# Altium schematic sheet STM32四轴.SchDoc
size A3
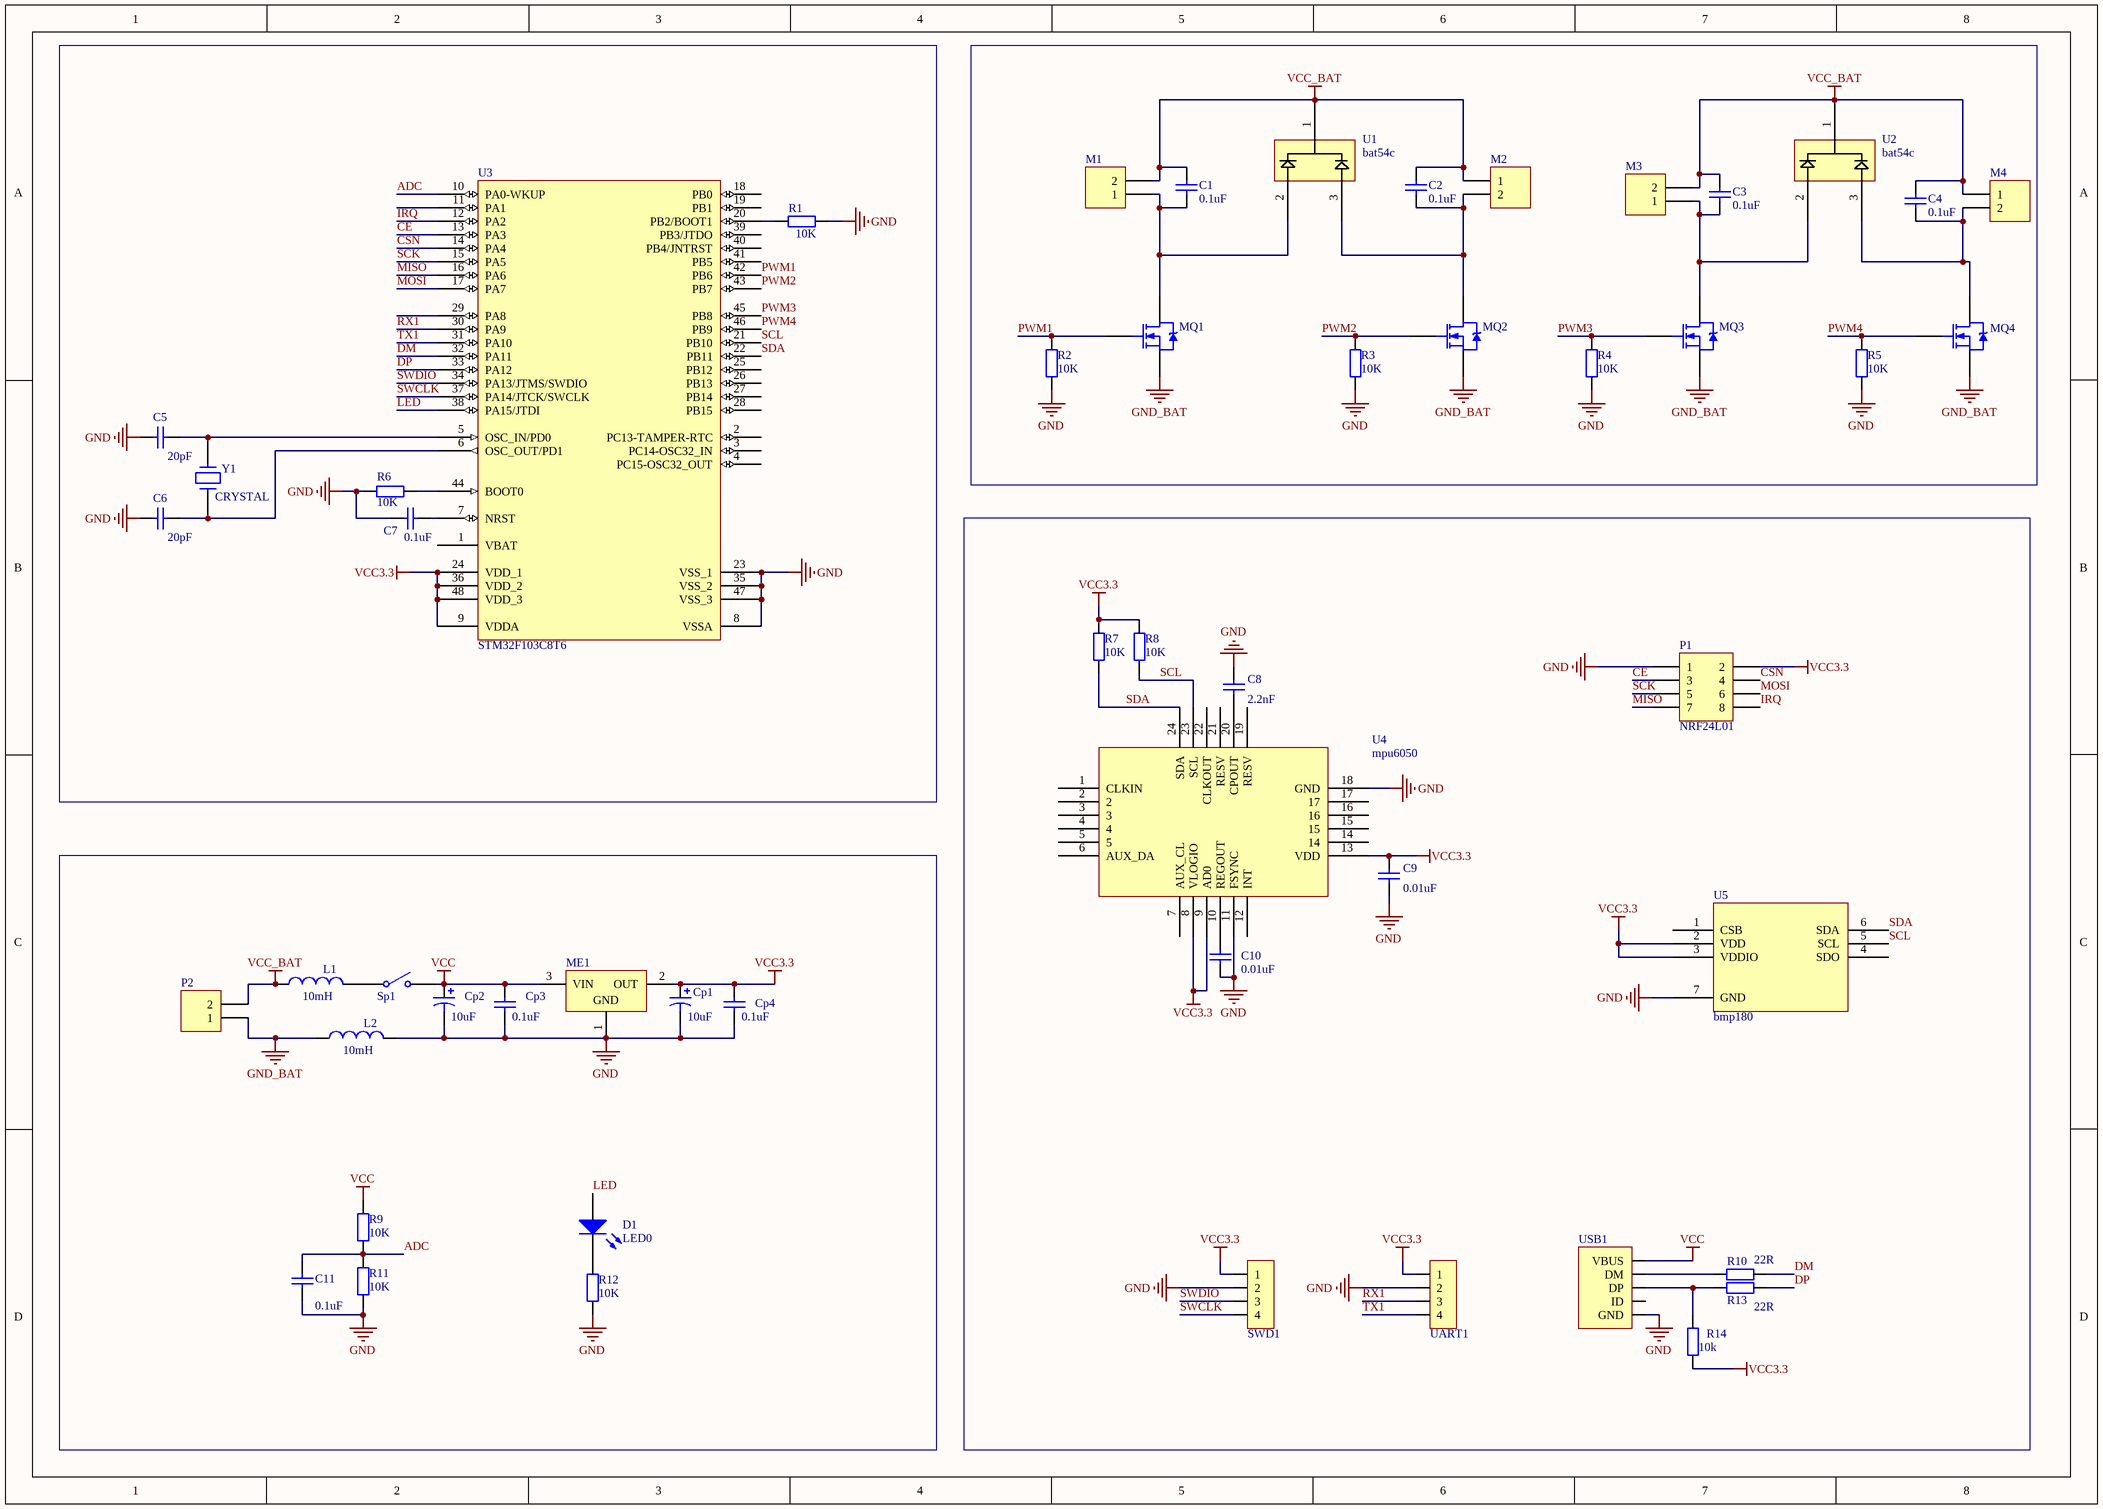
[diagram p0: STM32四轴.SchDoc]

## Parts
C1  value 0.1uF  [0805s]  (hidden comment: Cap)
C2  value 0.1uF  [0805s]  (hidden comment: Cap)
C3  value 0.1uF  [0805s]  (hidden comment: Cap)
C4  value 0.1uF  [0805s]  (hidden comment: Cap)
C5  value 20pF  [0805s]  (hidden comment: Cap)
C6  value 20pF  [0805s]  (hidden comment: Cap)
C7  value 0.1uF  [0805s]  (hidden comment: Cap)
C8  value 2.2nF  [0805s]  (hidden comment: Cap)
C9  value 0.01uF  [0805s]  (hidden comment: Cap)
C10  value 0.01uF  [0805s]  (hidden comment: Cap)
C11  value 0.1uF  [0805s]  (hidden comment: Cap)
Cp1  value 10uF  [3216]  (hidden comment: Cap Pol1)
Cp2  value 10uF  [3216]  (hidden comment: Cap Pol1)
Cp3  value 0.1uF  [0805s]  (hidden comment: Cap)
Cp4  value 0.1uF  [0805s]  (hidden comment: Cap)
D1  LED0  [0805s]
L1  value 10mH  [0805s]  (hidden comment: Inductor)
L2  value 10mH  [0805s]  (hidden comment: Inductor)
M1  Header 2  [0805s]  (value not drawn)
M2  Header 2  [0805s]  (value not drawn)
M3  Header 2  [0805s]  (value not drawn)
M4  Header 2  [0805s]  (value not drawn)
ME1  Volt Reg  [SOT-23]  (value not drawn)
MQ1  NMOS-2  [SOT-23]  (value not drawn)
MQ2  NMOS-2  [SOT-23]  (value not drawn)
MQ3  NMOS-2  [SOT-23]  (value not drawn)
MQ4  NMOS-2  [SOT-23]  (value not drawn)
P1  NRF24L01  [HDR2X4]
P2  Header 2  [SIP2]  (value not drawn)
R1  value 10K  [0805s]  (hidden comment: Res2)
R2  value 10K  [0805s]  (hidden comment: Res2)
R3  value 10K  [0805s]  (hidden comment: Res2)
R4  value 10K  [0805s]  (hidden comment: Res2)
R5  value 10K  [0805s]  (hidden comment: Res2)
R6  value 10K  [0805s]  (hidden comment: Res2)
R7  value 10K  [0805s]  (hidden comment: Res2)
R8  value 10K  [0805s]  (hidden comment: Res2)
R9  value 10K  [0805s]  (hidden comment: Res2)
R10  value 22R  [0805s]  (hidden comment: Res_0603)
R11  value 10K  [0805s]  (hidden comment: Res2)
R12  value 10K  [0805s]  (hidden comment: Res2)
R13  value 22R  [0805s]  (hidden comment: Res_0603)
R14  value 10k  [0805s]  (hidden comment: Res_0603)
Sp1  SW-SPST  [SIP3]  (value not drawn)
SWD1  HDR1X4_180_2.54  [SIP4]  (value not drawn)
U1  bat54c  [SOT-23]
U2  bat54c  [SOT-23]
U3  STM32F103C8T6  [LQFP48]
U4  mpu6050  [MPU6050]
U5  bmp180  [LCC8]
UART1  HDR1X4_180_2.54  [SIP4]  (value not drawn)
USB1  USB_Micro  [MICRO-USB]  (value not drawn)
Y1  CRYSTAL  [SIP2]

## Nets
GND: C5.1 C6.1 C7.1 C8.2 C9.1 C10.1 C11.1 Cp1.2 Cp2.2 Cp3.1 Cp4.1 L2.2 ME1.1(GND) P1.1 R1.2 R2.2 R3.2 R4.2 R5.2 R6.2 R11.1 R12.1 SWD1.2 U3.8(VSSA) U3.23(VSS_1) U3.35(VSS_2) U3.47(VSS_3) U4.11(FSYNC) U4.18(GND) U5.7(GND) UART1.2 USB1.5(GND)
GND_BAT: L2.1 MQ1.2(S) MQ2.2(S) MQ3.2(S) MQ4.2(S) P2.1
VCC: Cp2.1 Cp3.2 ME1.3(VIN) R9.2 Sp1.2(NO) USB1.1(VBUS)
VCC3.3: C9.2 Cp1.1 Cp4.2 ME1.2(OUT) P1.2 R7.2 R8.2 R14.2 SWD1.1 U3.9(VDDA) U3.24(VDD_1) U3.36(VDD_2) U3.48(VDD_3) U4.8(VLOGIO) U4.9(AD0) U4.13(VDD) U5.2(VDD) U5.3(VDDIO) UART1.1
VCC_BAT: C1.1 C2.1 C3.1 C4.1 L1.1 M1.2 M2.1 M3.2 M4.1 P2.2 U1.1 U2.1
ADC: C11.2 R9.1 R11.2 U3.10(PA0-WKUP)
CE: P1.3 U3.13(PA3)
CSN: P1.4 U3.14(PA4)
DM: R10.2 U3.32(PA11)
DP: R13.2 U3.33(PA12)
IRQ: P1.8 U3.12(PA2)
LED: D1.1(A) U3.38(PA15/JTDI)
MISO: P1.7 U3.16(PA6)
MOSI: P1.6 U3.17(PA7)
PWM1: MQ1.1(G) R2.1 U3.42(PB6)
PWM2: MQ2.1(G) R3.1 U3.43(PB7)
PWM3: MQ3.1(G) R4.1 U3.45(PB8)
PWM4: MQ4.1(G) R5.1 U3.46(PB9)
RX1: U3.30(PA9) UART1.3
SCK: P1.5 U3.15(PA5)
SCL: R8.1 U3.21(PB10) U4.23(SCL) U5.5(SCL)
SDA: R7.1 U3.22(PB11) U4.24(SDA) U5.6(SDA)
SWCLK: SWD1.4 U3.37(PA14/JTCK/SWCLK)
SWDIO: SWD1.3 U3.34(PA13/JTMS/SWDIO)
TX1: U3.31(PA10) UART1.4
NetC1_2: C1.2 M1.1 MQ1.3(D) U1.2
NetC2_2: C2.2 M2.2 MQ2.3(D) U1.3
NetC3_2: C3.2 M3.1 MQ3.3(D) U2.2
NetC4_2: C4.2 M4.2 MQ4.3(D) U2.3
NetC5_2: C5.2 U3.5(OSC_IN/PD0) Y1.2
NetC6_2: C6.2 U3.6(OSC_OUT/PD1) Y1.1
NetC7_2: C7.2 U3.7(NRST)
NetC8_1: C8.1 U4.20(CPOUT)
NetC10_2: C10.2 U4.10(REGOUT)
NetD1_2: D1.2(K) R12.2
NetL1_2: L1.2 Sp1.1(COMMON)
NetR1_1: R1.1 U3.20(PB2/BOOT1)
NetR6_1: R6.1 U3.44(BOOT0)
NetR10_1: R10.1 USB1.2(DM)
NetR13_1: R13.1 R14.1 USB1.3(DP)

Not connected (* = marked no-connect by the designer): U3 1(VBAT) 2(PC13-TAMPER-RTC) 3(PC14-OSC32_IN) 4(PC15-OSC32_OUT) 11(PA1) 18(PB0) 19(PB1) 25(PB12) 26(PB13) 27(PB14) 28(PB15) 29(PA8) 39(PB3/JTDO) 40(PB4/JNTRST) 41(PB5); U4 1(CLKIN) 2 3 4 5 6(AUX_DA) 7(AUX_CL) 12(INT) 14 15 16 17 19(RESV) 21(RESV) 22(CLKOUT); U5 1(CSB) 4(SDO); USB1 4(ID)

## Library data of the parts
C1-C11 Cp3 Cp4 = Cap: Capacitor; Published: 8-Jun-2000; LatestRevisionDate: 17-Jul-2002; LatestRevisionNote: Re-released for DXP Platform.; PackageReference: RAD-0.3; Publisher: Altium Limited
Cp1 Cp2 = Cap Pol1: Polarized Capacitor (Radial); Published: 8-Jun-2000; LatestRevisionDate: 17-Jul-2002; LatestRevisionNote: Re-released for DXP Platform.; PackageReference: RB7.6-15; Publisher: Altium Limited
D1 = LED0: Typical INFRARED GaAs LED; Published: 8-Jun-2000; LatestRevisionDate: 08-Jul-2005; LatestRevisionNote: Mech Layer 1 removed.; PackageReference: LED-0; Publisher: Altium Limited
L1 L2 = Inductor: Code_IEC: 1005; Published: 8-Jun-2000; LatestRevisionDate: 29-May-2009; LatestRevisionNote: IPC-7351 Footprint Added.; PackageReference: 0402-A; Publisher: Altium Limited; PackageDescription: Chip Inductor; Code_JEITA: 0402
M1-M4 P2 = Header 2: Header, 2-Pin; LatestRevisionDate: 17-Jul-2002; LatestRevisionNote: Re-released for DXP Platform.; Publisher: Altium Limited
ME1 = Volt Reg: Voltage Regulator; Published: 24-Mar-1999; LatestRevisionDate: 29-May-2009; LatestRevisionNote: IPC-7351 Footprint Added.; PackageReference: D2PAK; Publisher: Altium Limited; PackageDescription: 3-Pin Transistor Outline Package 2.54 mm Pitch, 15.1 mm Lead Span
MQ1-MQ4 = NMOS-2: N-Channel Power MOSFET; Note: Pin 2 is electrically connected to pin 4.; Published: 8-Jun-2000; LatestRevisionDate: 17-Jul-2002; LatestRevisionNote: Re-released for DXP Platform.; DatasheetVersion: PD-9.814; PackageReference: TO-220AB; Publisher: Altium Limited; Code_JEDEC: TO-220-AB; ComponentLink1Description: Manufacturer Link; ComponentLink1URL: http://www.irf.com/
P1 = MHDR2X4: Header, 4-Pin, Dual row; LatestRevisionDate: 17-Jul-2002; LatestRevisionNote: Re-released for DXP Platform.; Publisher: Altium Limited
R1-R9 R11 R12 = Res2: Resistor; Published: 8-Jun-2000; LatestRevisionDate: 17-Jul-2002; LatestRevisionNote: Re-released for DXP Platform.; PackageReference: AXIAL-0.4; Publisher: Altium Limited
R10 R13 R14 = Res_0603: Resistor
Sp1 = SW-SPST: Single-Pole, Single-Throw Switch; Published: 24-Mar-1999; LatestRevisionDate: 17-Jul-2002; LatestRevisionNote: Re-released for DXP Platform.; PackageReference: SPST-2; Publisher: Altium Limited
SWD1 UART1 = HDR1X4_180_2.54: Header
U3 = STM32F103C8T6: STM32 ARM-based 32-bit MCU with 64 Kbytes Flash, 48-pin LQFP, Industrial Temperature; Published: 30-May-2008; DatasheetVersion: rev6, Mar-2008; PackageVersion: Mar-2008; PackageReference: LQFP48; Publisher: Altium Limited; PackageDescription: 48-Pin Low-Profile Quad Flat Pack, 7 x 7 mm Body, 0.5 mm Pitch (LQFP48); ComponentLink1Description: Manufacturer Link; ComponentLink1URL: www.st.com/stm32; ComponentLink2Description: Datasheet; ComponentLink2URL: http://www.st.com/stonline/products/literature/ds/13587.pdf
USB1 = USB_Micro: USB